# EasyEDA Pro project MCUPCB.eprj

# Schematic S1
Create Date: 2023-04-21; Page Name: P1; Project Name: MCUPCB; Schematic Name: S1; Update Date: 2023-06-19; Company: 嘉立创EDA; Page Size: A4; Version: V1.0
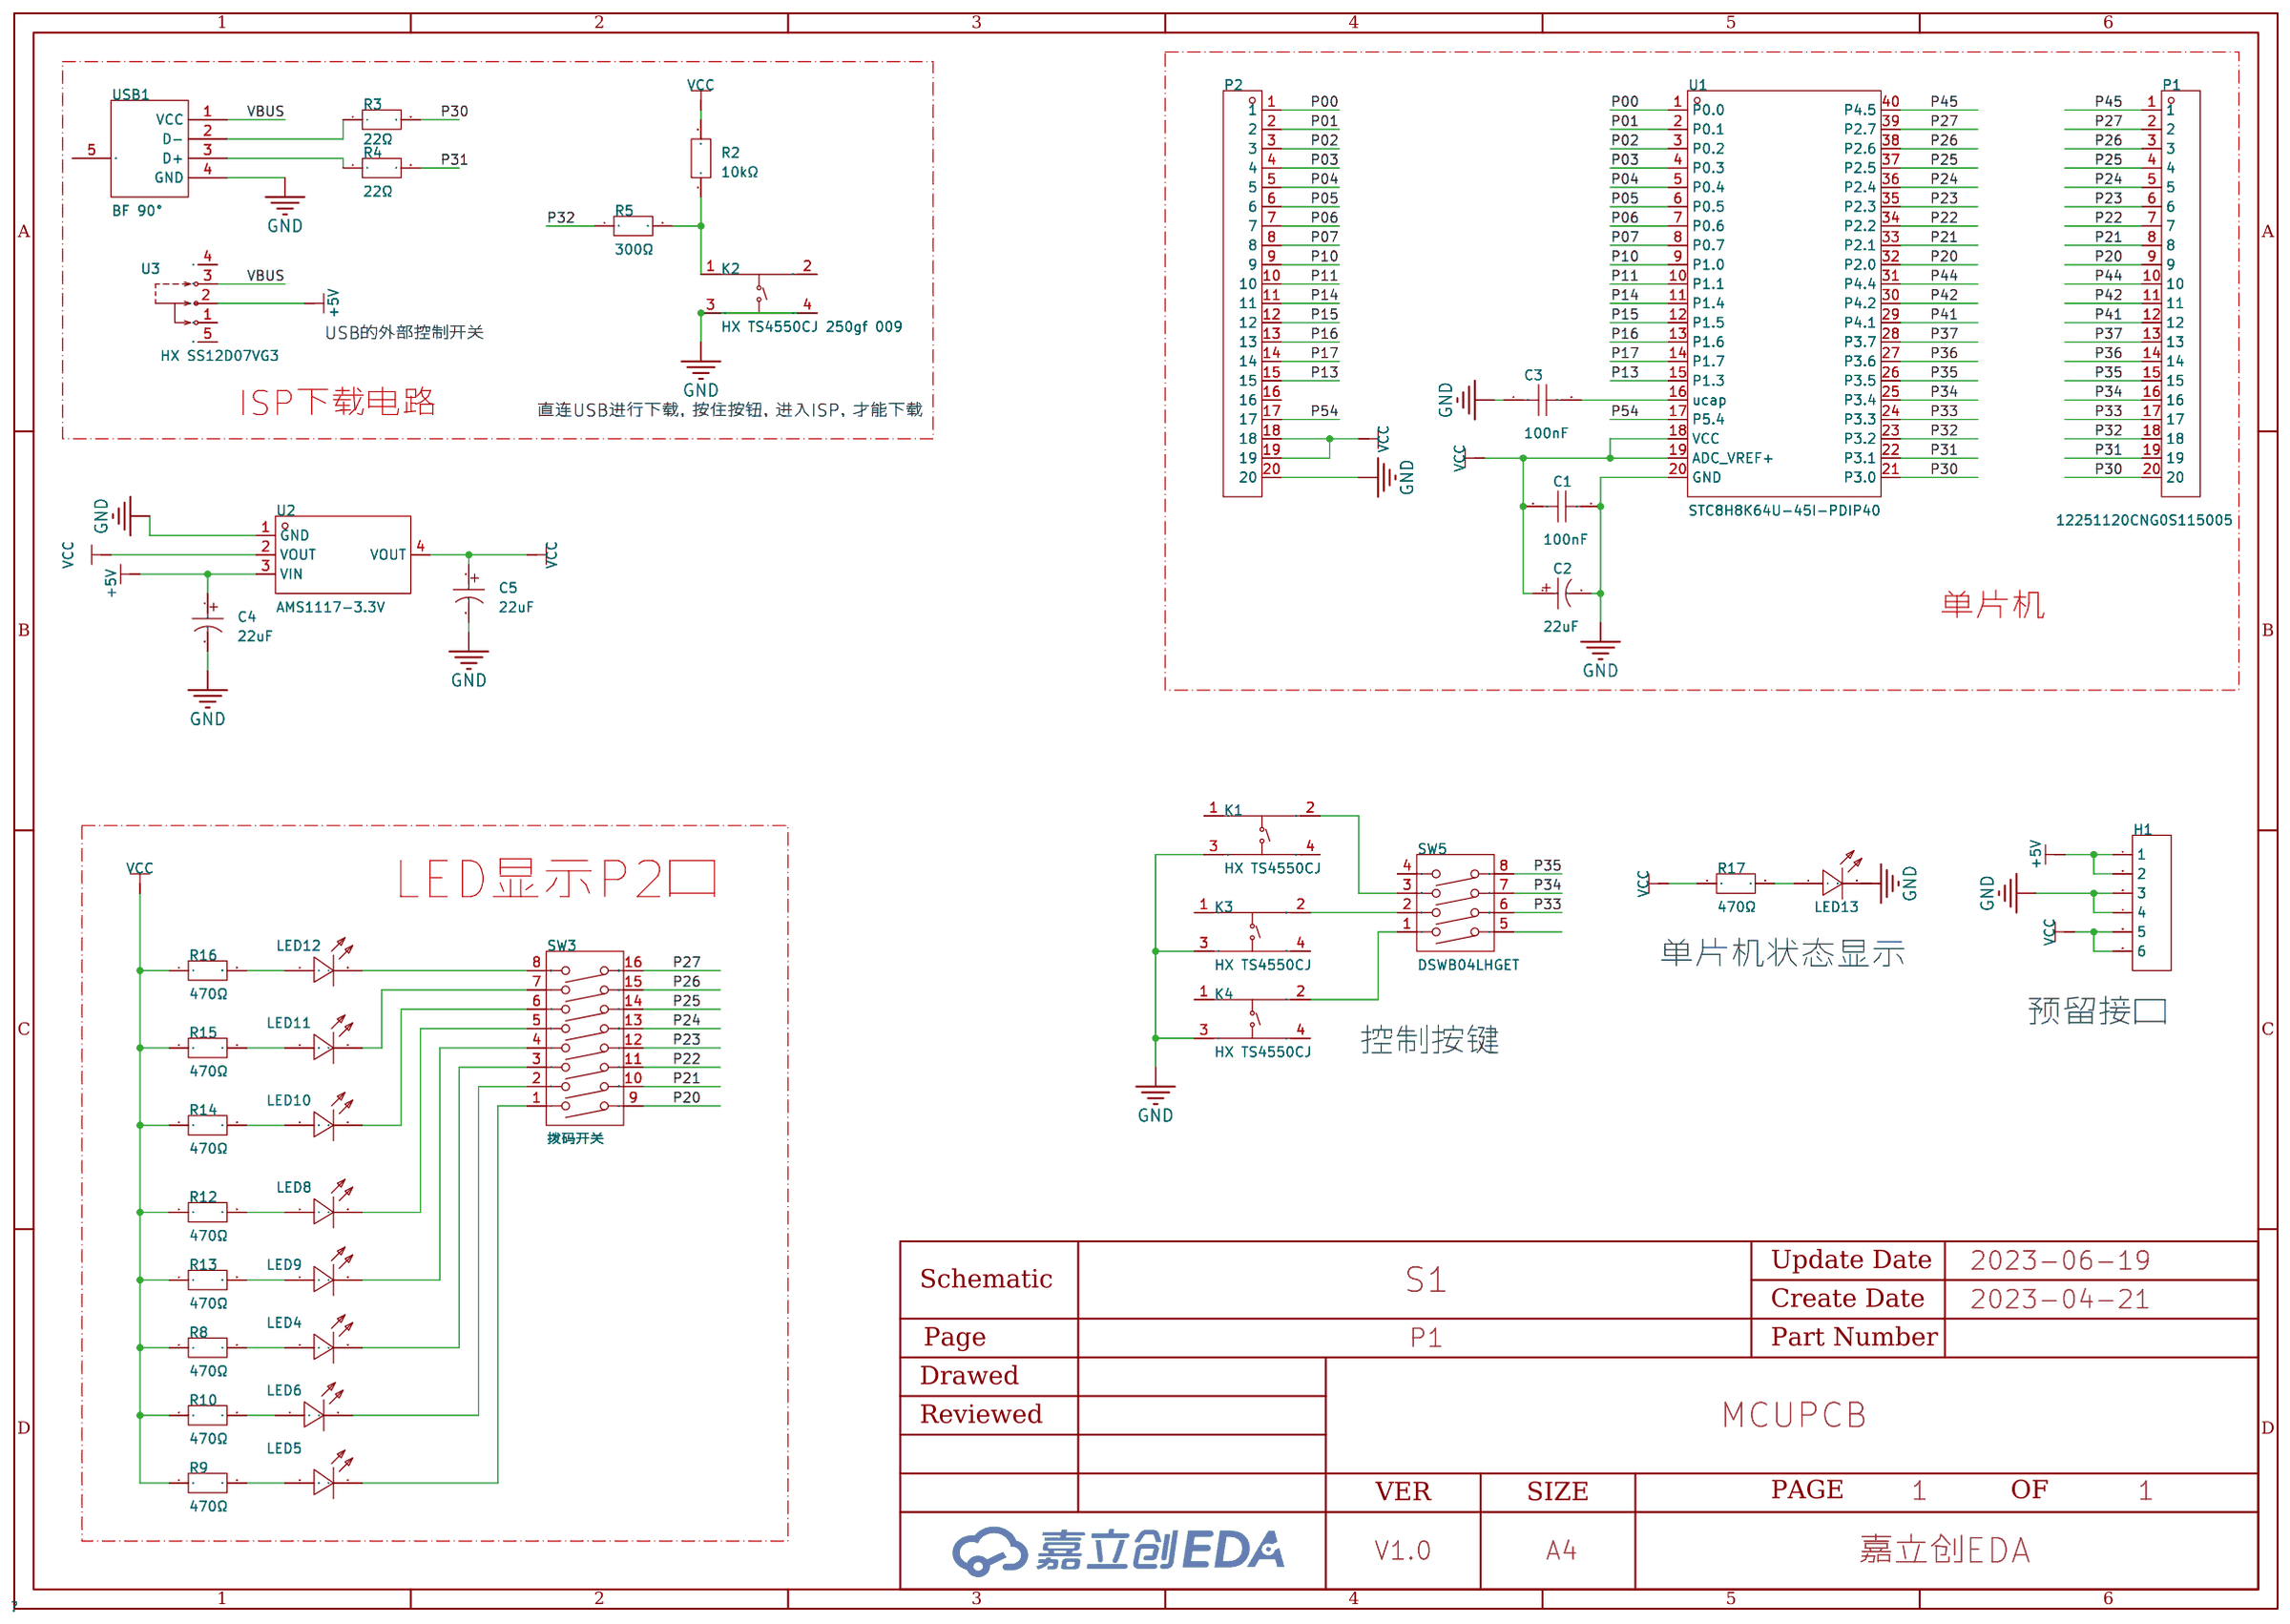
[diagram p0: schematic sheet]

## Parts
C1  100nF  [CAP-TH_L4.2-W3.8-P2.54-D0.5]
C2  22uF  [CAP-TH_BD4.0-P1.50-D0.8-FD]
C3  100nF  [CAP-TH_L4.2-W3.8-P2.54-D0.5]
C4  22uF  [CAP-TH_BD4.0-P1.50-D0.8-FD]
C5  22uF  [CAP-TH_BD4.0-P1.50-D0.8-FD]
H1  -  [HDR-TH_6P-P2.54-V-M-1]
K1  HX TS4550CJ  [SW-TH_4P-L4.5-W4.5-P3.00-LS5.0]
K2  HX TS4550CJ 250gf 009  [SW-TH_4P-L4.5-W4.5-P3.00-LS5.0]
K3  HX TS4550CJ  [SW-TH_4P-L4.5-W4.5-P3.00-LS5.0]
K4  HX TS4550CJ  [SW-TH_4P-L4.5-W4.5-P3.00-LS5.0]
LED4  TJ-L3FYTLDRMFCSFLC2R-A5  [LED-TH_BD3.8-P2.54-FD]
LED5  TJ-L3FYTLDRMFCSFLC2R-A5  [LED-TH_BD3.8-P2.54-FD]
LED6  TJ-L3FYTLDRMFCSFLC2R-A5  [LED-TH_BD3.8-P2.54-FD]
LED8  TJ-L3FYTLDRMFCSFLC2R-A5  [LED-TH_BD3.8-P2.54-FD]
LED9  TJ-L3FYTLDRMFCSFLC2R-A5  [LED-TH_BD3.8-P2.54-FD]
LED10  TJ-L3FYTLDRMFCSFLC2R-A5  [LED-TH_BD3.8-P2.54-FD]
LED11  TJ-L3FYTLDRMFCSFLC2R-A5  [LED-TH_BD3.8-P2.54-FD]
LED12  TJ-L3FYTLDRMFCSFLC2R-A5  [LED-TH_BD3.8-P2.54-FD]
LED13  TJ-L3FYTLDRMFCSFLC2R-A5  [LED-TH_BD3.8-P2.54-FD]
P1  12251120CNG0S115005  [HDR-TH_20P-P2.54-V-M-1]
P2  12251120CNG0S115005  [HDR-TH_20P-P2.54-V-M-1]
R2  10kΩ  [RES-TH_BD2.7-L6.2-P10.20-D0.4]
R3  22Ω  [RES-TH_BD2.7-L6.2-P10.20-D0.4]
R4  22Ω  [RES-TH_BD2.7-L6.2-P10.20-D0.4]
R5  300Ω  [RES-TH_BD2.7-L6.2-P10.20-D0.4]
R8  470Ω  [RES-TH_BD2.3-L6.5-P10.50-D0.5]
R9  470Ω  [RES-TH_BD2.3-L6.5-P10.50-D0.5]
R10  470Ω  [RES-TH_BD2.3-L6.5-P10.50-D0.5]
R12  470Ω  [RES-TH_BD2.3-L6.5-P10.50-D0.5]
R13  470Ω  [RES-TH_BD2.3-L6.5-P10.50-D0.5]
R14  470Ω  [RES-TH_BD2.3-L6.5-P10.50-D0.5]
R15  470Ω  [RES-TH_BD2.3-L6.5-P10.50-D0.5]
R16  470Ω  [RES-TH_BD2.3-L6.5-P10.50-D0.5]
R17  470Ω  [RES-TH_BD2.3-L6.5-P10.50-D0.5]
SW3  拨码开关  [SW-TH_DSWB08LHGET]
SW5  DSWB04LHGET  [SW-TH_DSWB04LHGET]
U1  STC8H8K64U-45I-PDIP40  [PDIP-40_L52.3-W13.7-P2.54-LS15.5-BL]
U2  AMS1117-3.3V  [SOT-223_L6.5-W3.5-P2.30-LS7.0-BR]
U3  HX SS12D07VG3  [SW-TH_SS12D07VG3]
USB1  BF 90°  [USB-B_TH_BF90]

## Library data of the parts
C1 C3 = CT4-0805B104K500F1: 容值:100nF;精度:±10%;额定电压:50V;温度系数:X7R;; LCSC Part Name: 100nF ±10% 50V; Supplier Part: C168753; Manufacturer: FH(风华); Supplier Footprint: 插件,P=2.54mm; JLCPCB Part Class: Extended Part; Datasheet: https://atta.szlcsc.com/upload/public/pdf/source/20180105/C168753_15151362164411233682.pdf; Supplier: LCSC; Tolerance: ±10%; Voltage Rated: 50V; Temperature Coefficient: X7R
C2 C4 C5 = KS226M016C07RR0VH2FP0: 容值:22uF;精度:±20%;额定电压:16V;纹波电流:-;等效串联电阻:-;; LCSC Part Name: 22uF ±20% 16V; Supplier Part: C43845; Manufacturer: CX(承兴); Supplier Footprint: 插件,D4xL7mm; JLCPCB Part Class: Extended Part; Datasheet: https://atta.szlcsc.com/upload/public/pdf/source/20211027/7B10195EF01EB9374BE8935690E3D906.pdf; Supplier: LCSC; Tolerance: ±20%; Rated Voltage: 16V; φD: 4mm; L: 7mm; Lead Spacing: 1.5mm; Lifetime @ Temp: 1000hrs@105℃
H1 = HDR-M_2.54_1x6P: Supplier Part: C37208; Supplier Footprint: 插件
K1-K4 = HX TS4550CJ 250gf 009: 触点电流：50mA 额定电压(DC)：12V 绝缘电阻：100MΩ 电路结构：单刀单掷 安装方式：直插 按钮形状：圆形按钮 按钮/盖帽颜色：黑色 带灯：无 作用力：250gf±50gf 机械寿命：100000 工作温度：-25℃~+70℃ 开关长度：4.5mm 开关宽度：4.5mm 开关高度：5mm; LCSC Part Name: 轻触开关插件 4.5*4.5*5mm按键开关 不锈钢弹片 250gf 四脚立式; Supplier Part: C5340174; Manufacturer: hanxia(韩下); Supplier Footprint: 插件; Datasheet: https://atta.szlcsc.com/upload/public/pdf/source/20221229/359234EF85A7F98504074081EE7E7D39.pdf; Supplier: LCSC
LED4-LED6 LED8-LED13 = TJ-L3FYTLDRMFCSFLC2R-A5: 发光颜色:橙红;二极管配置:-;主波长:620nm~630nm;色温:-;功率:72mW;安装方式:-;; LCSC Part Name: 橙红 圆头 短脚; Supplier Part: C440523; Manufacturer: TOGIALED(统佳); Supplier Footprint: 插件,D=3mm; JLCPCB Part Class: Extended Part; Datasheet: https://atta.szlcsc.com/upload/public/pdf/source/20191029/C440523_9662C3EC1D82ED90715B43211F389690.pdf; Supplier: LCSC; Emitted Color: 橙红; Lens Color: 雾状红; Dominant Wavelength: 620nm~630nm; Peak Wavelength: 630nm; Forward Current: 20mA; Power Dissipation: 72mW; Viewing Angle: 45°; Operating Temperature: -20℃~+80℃; Lamp Holder Type: 3mm圆形灯头
P1 P2 = 12251120CNG0S115005: 排数:单排;总PIN位数:20;间距:2.54mm;插针结构:1x20P;行距:-;安装类型:直插;圆针/方针:方针;额定电流:3A;额定电压:-;配合针长度:6mm;塑高:2.5mm;端接针长度:3mm;触头材质:黄铜;触头镀层:-;工作温度范围:-40℃~+105℃;颜色:黑色;; LCSC Part Name: 2.54mm 1x20P 直插 方针; Supplier Part: C429964; Manufacturer: JILN(锦凌); Supplier Footprint: 直插,P=2.54mm; JLCPCB Part Class: Extended Part; Datasheet: https://atta.szlcsc.com/upload/public/pdf/source/20190920/C429964_97CF577D001CBBD1C5ADC89AE690F8A2.pdf; Supplier: LCSC; Number of Rows: 单排; Number of Pins: 20; Pitch: 2.54mm; Pin Structure: 1x20P; Mounting Type: 直插; Circluar Pins/Square Pins: 方针; Current Rating (Max): 3A; Length of Mating Pin: 6mm; Insulation Height: 2.5mm; Length of End Connection Pin: 3mm; Contact Material: 黄铜; Operating Temperature Range: -40℃~+105℃; Color: 黑色
R2 = CR1/4W-10K±5%-ST52: 电阻类型:碳膜电阻;阻值:10kΩ;精度:±5%;; LCSC Part Name: 碳膜电阻 10kΩ ±5%; Supplier Part: C2894649; Manufacturer: VO(翔胜); Supplier Footprint: 插件,2.7x6.2mm; JLCPCB Part Class: Extended Part; Datasheet: https://atta.szlcsc.com/upload/public/pdf/source/20210803/C2857407_45FF53FE186CAB545115AD37303966CD.pdf; Supplier: LCSC; Type: 碳膜电阻; Tolerance: ±5%; Temperature Coefficient: ±350ppm/℃; Overload Voltage (Max): 250V; Operating Temperature Range: -55℃~+155℃
R3 R4 = CR1/4W-22Ω±5%-RT52: 电阻类型:碳膜电阻;阻值:22Ω;精度:±5%;功率:250mW;温度系数:±350ppm/℃;最大工作电压:250V;工作温度范围:-55℃~+155℃;; LCSC Part Name: 碳膜电阻 22Ω ±5% 250mW; Supplier Part: C2894527; Manufacturer: VO(翔胜); Supplier Footprint: 插件,2.7x6.2mm; JLCPCB Part Class: Extended Part; Datasheet: https://atta.szlcsc.com/upload/public/pdf/source/20210803/C2857407_45FF53FE186CAB545115AD37303966CD.pdf; Supplier: LCSC; Type: 碳膜电阻; Tolerance: ±5%; Power(Watts): 250mW; Temperature Coefficient: ±350ppm/℃; Overload Voltage (Max): 250V; Operating Temperature Range: -55℃~+155℃
R5 = CR1/4W-300Ω±5%-ST26: 电阻类型:碳膜电阻;阻值:300Ω;精度:±5%;功率:250mW;温度系数:±350ppm/℃;最大工作电压:250V;工作温度范围:-55℃~+155℃;; LCSC Part Name: 碳膜电阻 300Ω ±5% 250mW; Supplier Part: C2894628; Manufacturer: VO(翔胜); Supplier Footprint: 插件,2.7x6.2mm; JLCPCB Part Class: Extended Part; Datasheet: https://atta.szlcsc.com/upload/public/pdf/source/20210803/C2857407_45FF53FE186CAB545115AD37303966CD.pdf; Supplier: LCSC; Type: 碳膜电阻; Tolerance: ±5%; Power(Watts): 250mW; Temperature Coefficient: ±350ppm/℃; Overload Voltage (Max): 250V; Operating Temperature Range: -55℃~+155℃
R8-R10 R12-R17 = CF1/4W-470Ω±5%T52: 电阻类型:碳膜电阻;阻值:470Ω;精度:±5%;功率:250mW;温度系数:-1500ppm/℃~+300ppm/℃;最大工作电压:250V;工作温度范围:-55℃~+125℃;; LCSC Part Name: 碳膜电阻 470Ω ±5% 250mW; Supplier Part: C714293; Manufacturer: 华星机电; Supplier Footprint: 轴向引线; JLCPCB Part Class: Extended Part; Datasheet: https://atta.szlcsc.com/upload/public/pdf/source/20200731/C714221_427FBDC3BB0D7DD1C4F442D16274C99B.pdf; Supplier: LCSC; Type: 碳膜电阻; Tolerance: ±5%; Power(Watts): 250mW; Temperature Coefficient: -1500ppm/℃~+300ppm/℃; Overload Voltage (Max): 250V; Operating Temperature Range: -55℃~+125℃
SW3 = 拨码开关,平拨开关,DSWB08LHGET: 类型:平拨，凸起式;电路结构:单刀单掷;开关位数:8;引脚间距:2.54mm;颜色:红色;; Supplier Part: C99413; Manufacturer: YE; Supplier Footprint: DIP-16; JLCPCB Part Class: Extended Part; Datasheet: https://atta.szlcsc.com/upload/public/pdf/source/20170330/1490854214069.pdf; Supplier: LCSC; Type: 平拨，凸起式; Circuit: 单刀单掷; Number of Positions: 8; Lead Pitch: 2.54mm; Color: 红色
SW5 = 拨码开关,平拨开关,DSWB04LHGET: 类型:平拨，凸起式;电路结构:单刀单掷;开关位数:4;引脚间距:2.54mm;颜色:红色;; Supplier Part: C99418; Manufacturer: YE; Supplier Footprint: DIP; JLCPCB Part Class: Extended Part; Datasheet: https://atta.szlcsc.com/upload/public/pdf/source/20220830/02827E67A8727938D957A3CE4C86C92D.pdf; Supplier: LCSC; Type: 平拨，凸起式; Circuit: 单刀单掷; Number of Positions: 4; Lead Pitch: 2.54mm; Color: 红色
U1 = STC8H8K64U-45I-PDIP40: 单片机@@全速USB，DMA支持：TFT彩屏接口，4个串口，SPI,ADC,RTC; Supplier Part: C2987962; Manufacturer: STC(宏晶); Supplier Footprint: PDIP-40; JLCPCB Part Class: Extended Part; Datasheet: https://atta.szlcsc.com/upload/public/pdf/source/20220208/F43AF8AFB82417D1483669F3A0ABE01D.pdf; Supplier: LCSC
U2 = AMS1117-3.3V_C173386: 输出类型:固定;输出极性:正;最大输入电压:12V;输出电压:3.3V;输出电流:800mA;电源纹波抑制比(PSRR):75dB@(10kHz);; LCSC Part Name: 输入12V 输出3.3V 800mA; Supplier Part: C173386; Manufacturer: FM(富满); Supplier Footprint: SOT-223; JLCPCB Part Class: Extended Part; Datasheet: https://atta.szlcsc.com/upload/public/pdf/source/20220413/D87C9CA81FB1DC5781774A1801C4CAE4.pdf; Supplier: LCSC; Output Type: 固定; Output Polarity: 正; Number of Outputs: 1; Maximum Input Voltage: 12V; Output Voltage: 3.3V; Dropout Voltage: 1.5V@(700mA); Output Current: 800mA; Power Supply Rejection Ratio (PSRR): 75dB@(10kHz)
U3 = HX SS12D07VG3: LCSC Part Name: 3脚2两档位SS12D07VG3 1P2T立式拨动开关,柄长3mm; Supplier Part: C5149825; Manufacturer: hanxia(韩下); Supplier Footprint: 插件; JLCPCB Part Class: Extended Part; Datasheet: https://atta.szlcsc.com/upload/public/pdf/source/20220907/9905FF2C6AFF0D7ECD846AFFBA045CCB.pdf; Supplier: LCSC
USB1 = BF 90°: 连接器类型:Type-B;标准:USB 2.0;公母:母座;触点数量:4;端口数量:1;安装方式:弯插;额定电流 - 电源:1.5A;工作温度范围:-25℃~+85℃;; LCSC Part Name: Type-B 母座 弯插 白胶 有后盖; Supplier Part: C456014; Manufacturer: SHOU HAN(首韩); Supplier Footprint: 插件; JLCPCB Part Class: Extended Part; Datasheet: https://atta.szlcsc.com/upload/public/pdf/source/20191113/C456014_C740506ED5D4B26CF619D62A688F072E.pdf; Supplier: LCSC; Connector Type: Type-B; Standard: USB 2.0; Gender: 母座; Number of Contacts: 4; Number of Ports: 1; Mounting Style: 弯插; Current Rating - Power (Max): 1.5A; Operating Temperature Range: -25℃~+85℃

## Nets
+5V: C4.1 H1.1 H1.2 U2.3(VIN) U3.2
GND: C1.1 C2.2 C3.1 C4.2 C5.2 H1.3 H1.4 K1.3(C) K2.3(C) K2.4(D) K3.3(C) K4.3(C) LED13.2(K) P2.20 U1.20(GND) U2.1(GND) USB1.4(GND)
VBUS: U3.3 USB1.1(VCC)
VCC: C1.2 C2.1 C5.1 H1.5 H1.6 P2.18 P2.19 R2.2 R8.1 R9.1 R10.1 R12.1 R13.1 R14.1 R15.1 R16.1 R17.1 U1.18(VCC) U1.19(ADC_VREF+) U2.2(VOUT) U2.4(VOUT)
P00: P2.1 U1.1(P0.0)
P01: P2.2 U1.2(P0.1)
P02: P2.3 U1.3(P0.2)
P03: P2.4 U1.4(P0.3)
P04: P2.5 U1.5(P0.4)
P05: P2.6 U1.6(P0.5)
P06: P2.7 U1.7(P0.6)
P07: P2.8 U1.8(P0.7)
P10: P2.9 U1.9(P1.0)
P11: P2.10 U1.10(P1.1)
P13: P2.15 U1.15(P1.3)
P14: P2.11 U1.11(P1.4)
P15: P2.12 U1.12(P1.5)
P16: P2.13 U1.13(P1.6)
P17: P2.14 U1.14(P1.7)
P20: P1.9 SW3.9 U1.32(P2.0)
P21: P1.8 SW3.10 U1.33(P2.1)
P22: P1.7 SW3.11 U1.34(P2.2)
P23: P1.6 SW3.12 U1.35(P2.3)
P24: P1.5 SW3.13 U1.36(P2.4)
P25: P1.4 SW3.14 U1.37(P2.5)
P26: P1.3 SW3.15 U1.38(P2.6)
P27: P1.2 SW3.16 U1.39(P2.7)
P30: P1.20 R3.2 U1.21(P3.0)
P31: P1.19 R4.2 U1.22(P3.1)
P32: P1.18 R5.1 U1.23(P3.2)
P33: P1.17 SW5.6 U1.24(P3.3)
P34: P1.16 SW5.7 U1.25(P3.4)
P35: P1.15 SW5.8 U1.26(P3.5)
P36: P1.14 U1.27(P3.6)
P37: P1.13 U1.28(P3.7)
P41: P1.12 U1.29(P4.1)
P42: P1.11 U1.30(P4.2)
P44: P1.10 U1.31(P4.4)
P45: P1.1 U1.40(P4.5)
P54: P2.17 U1.17(P5.4)
$1N1688: K2.1(A) R2.1 R5.2
$1N1822: R3.1 USB1.2(D-)
$1N1826: R4.1 USB1.3(D+)
$1N2054: C3.2 U1.16(ucap)
$1N3268: LED4.1(A) R8.2
$1N3345: LED5.1(A) R9.2
$1N3423: LED6.1(A) R10.2
$1N3487: LED4.2(K) SW3.3
$1N3491: LED6.2(K) SW3.2
$1N3495: LED5.2(K) SW3.1
$1N3652: LED8.1(A) R12.2
$1N3729: LED9.1(A) R13.2
$1N3822: LED10.1(A) R14.2
$1N3899: LED11.1(A) R15.2
$1N3906: LED9.2(K) SW3.4
$1N3914: LED8.2(K) SW3.5
$1N3922: LED10.2(K) SW3.6
$1N4027: LED12.1(A) R16.2
$1N4031: LED11.2(K) SW3.7
$1N4039: LED12.2(K) SW3.8
$1N4277: K3.2(B) SW5.2
$1N4282: K4.2(B) SW5.1
$1N4288: K1.2(B) SW5.3
$1N5607: LED13.1(A) R17.2

Not connected (* = marked no-connect by the designer): K1 1(A) 4(D); K2 2(B); K3 1(A) 4(D); K4 1(A) 4(D); P2 16; SW5 4 5; U3 1 4 5; USB1 5(EH)

## Notes on the sheet
- USB的外部控制开关
- ISP下载电路
- 直连USB进行下载，按住按钮，进入ISP，才能下载
- 单片机
- LED显示P2口
- 单片机状态显示
- 预留接口
- 控制按键

# Board PCB1
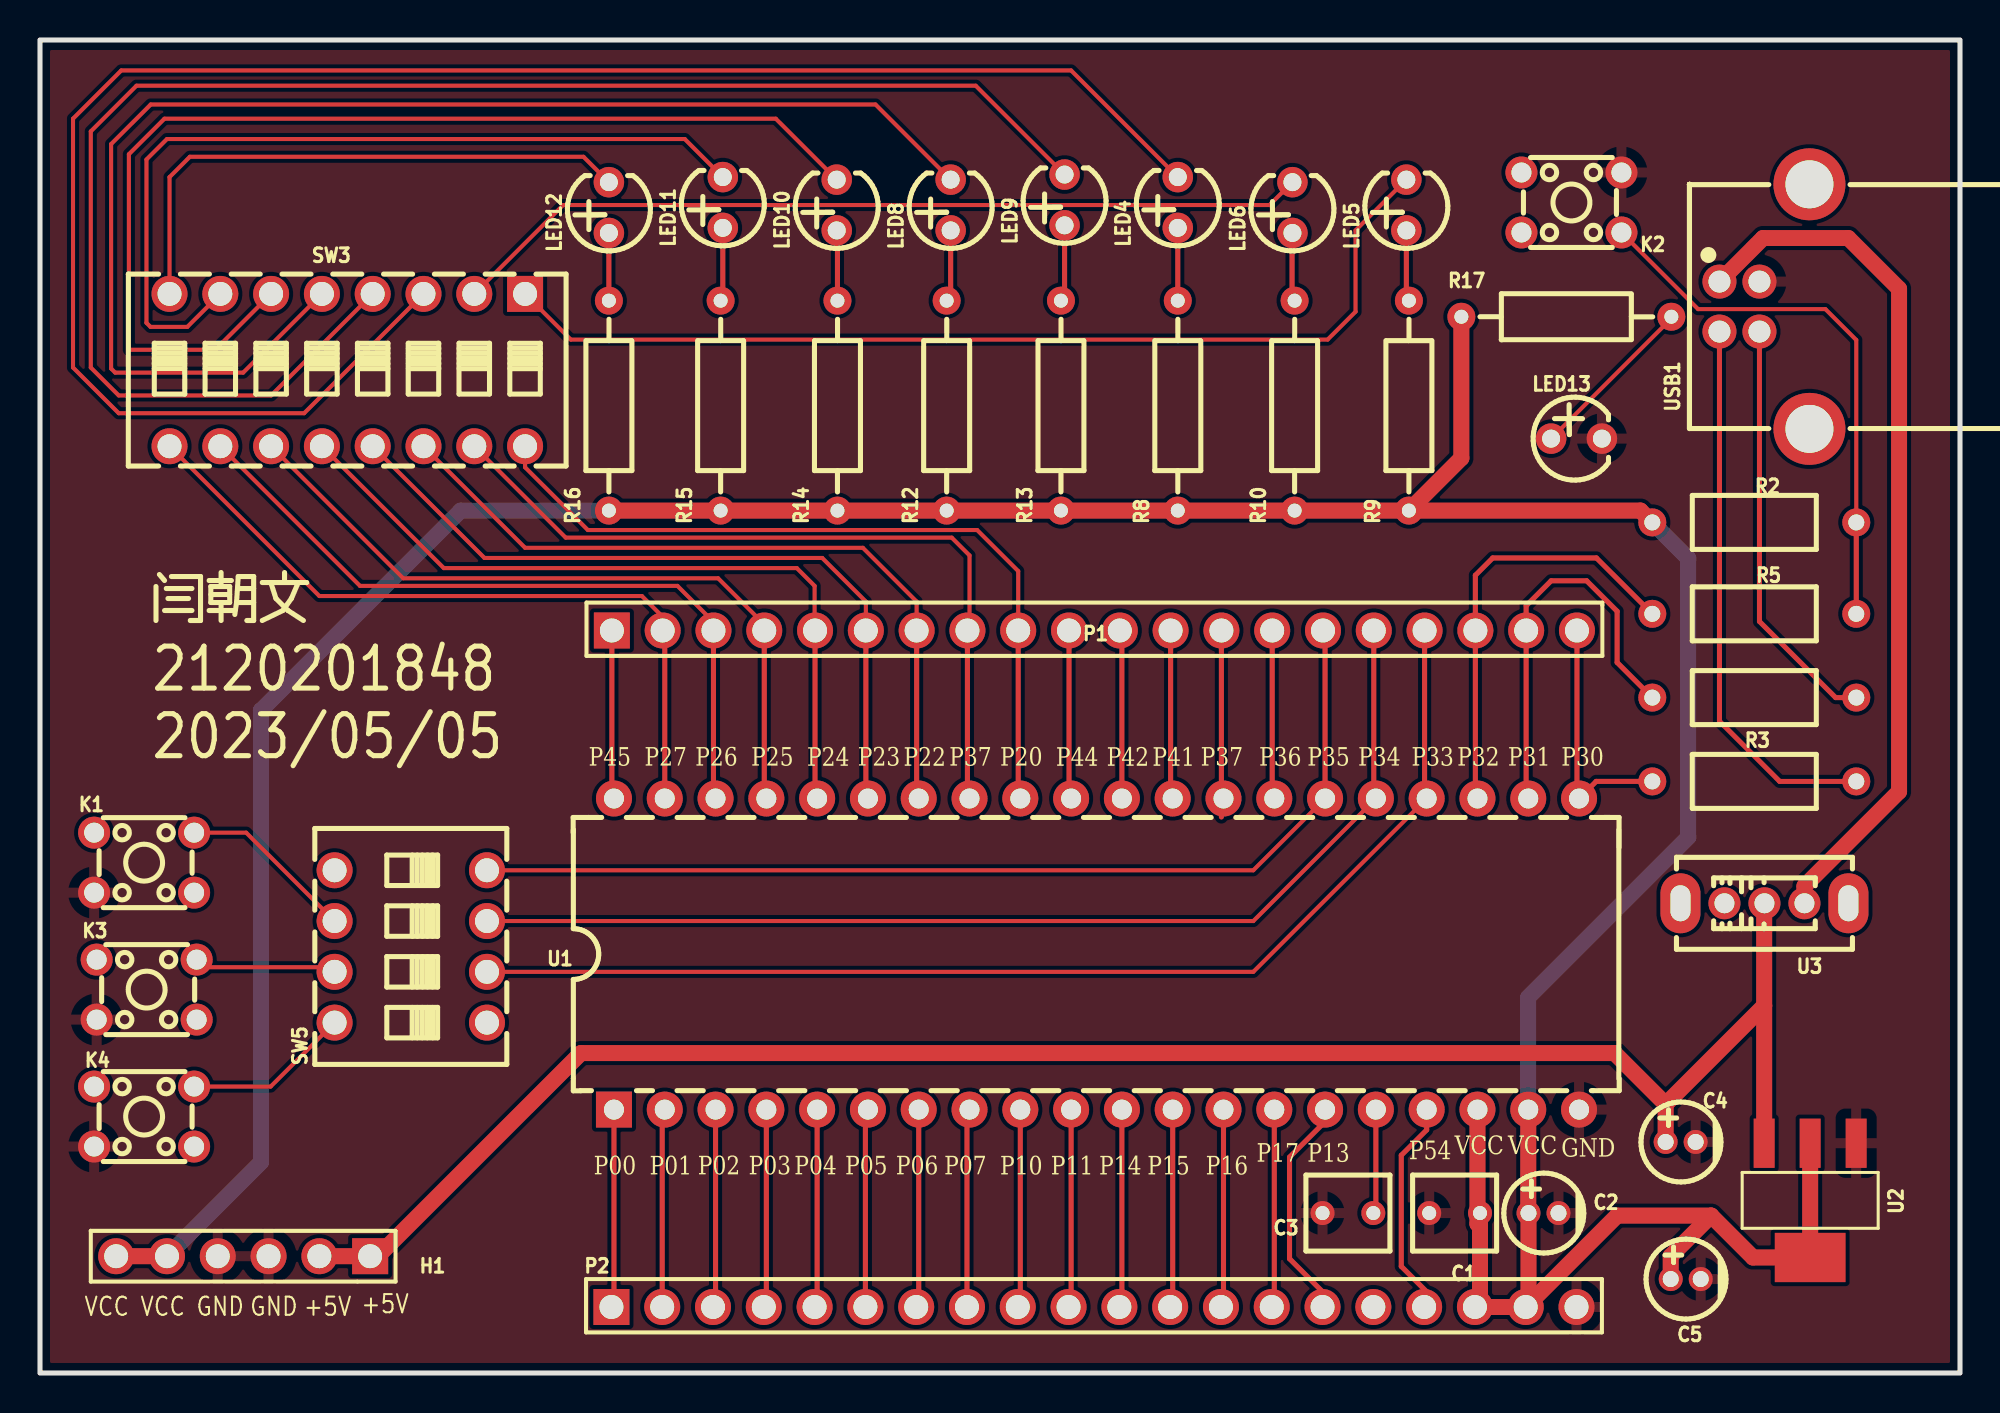
[diagram p1: board, top side]
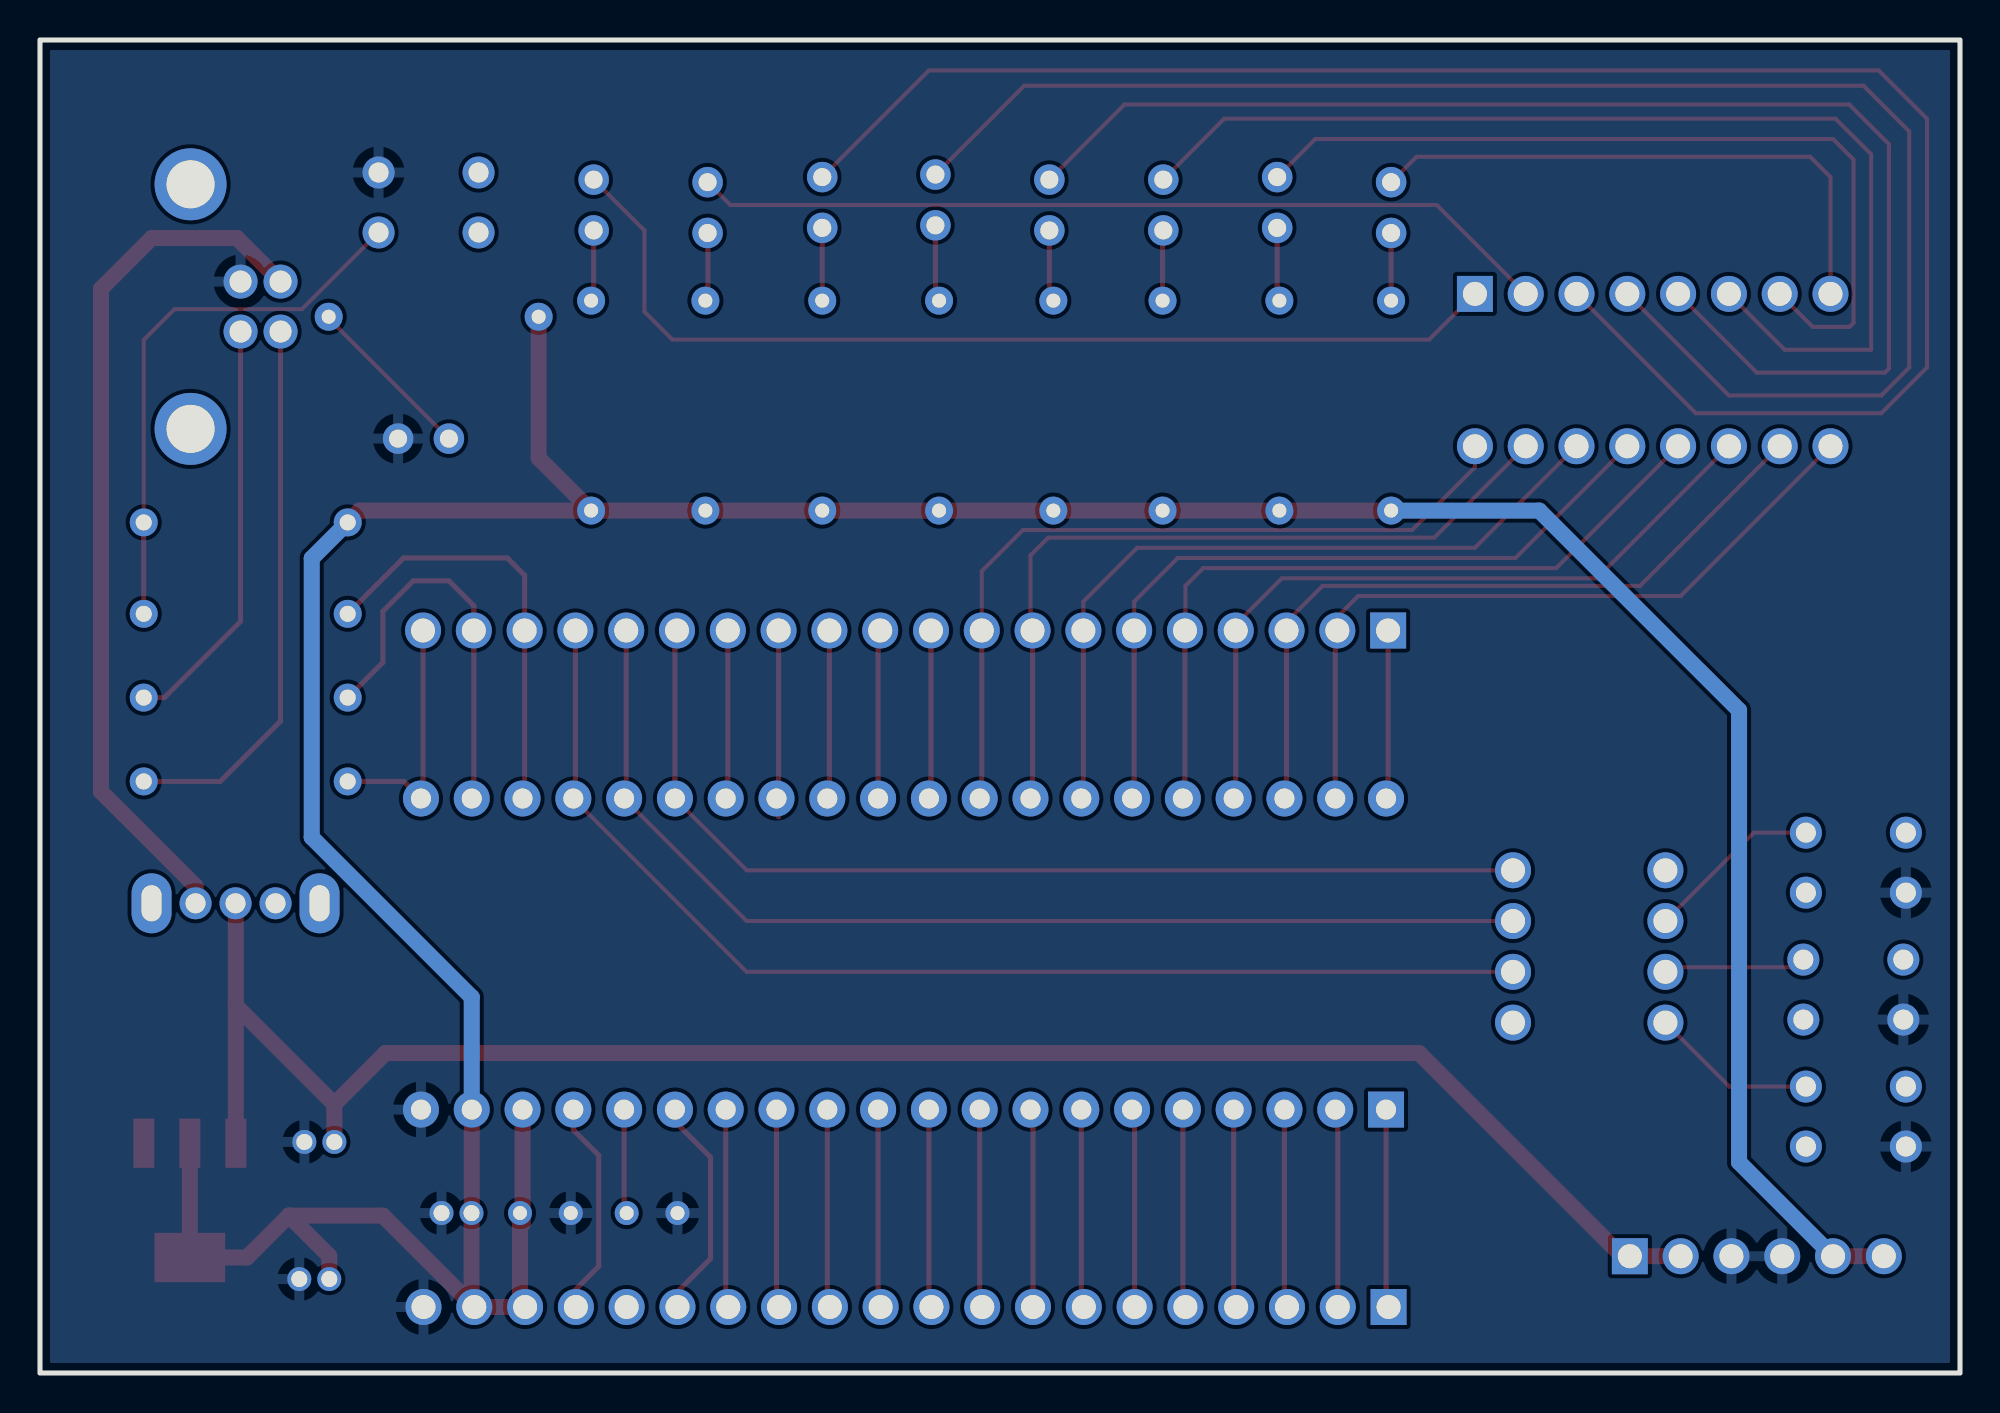
[diagram p2: board, bottom side, seen from below]

Outline 96.01 x 66.67 mm; copper layers: Top Layer, Bottom Layer. Coordinates in mm from the lower left corner of the outline.
Outline path: rectangle 0,66.67 96.01,0
Stack: Top Layer 0.035mm / Dielectric1 1.51mm FR4 er 4.5 / Bottom Layer 0.035mm

## Design rules (mm)
template: JLCPCB Capability(Two Layers Board)
spacing copperThickness1oz (default): track to track 0.102, other pairs 0.152 to 0.3
spacing copperThickness2oz: track to track 0.203, other pairs 0.152 to 0.3
track width copperThickness1oz (default): min 0.127, default 0.254, max 2.54
track width copperThickness2oz: min 0.203, default 0.254, max 2.54
differential pair differentialPair (default): width min 0.127, default 0.254, max 2.54; gap min 0.152, default 0.152
via viaSize (default): diameter min 0.5, default 0.61, max 10; hole min 0.3, default 0.305, max 6.3

## Placement (name value [footprint] x y rotation side)
C1  100nF  [CAP-TH_L4.2-W3.8-P2.54-D0.5]  70.74 8 0 top
C2  22uF  [CAP-TH_BD4.0-P1.50-D0.8-FD]  75.18 8 0 top
C3  100nF  [CAP-TH_L4.2-W3.8-P2.54-D0.5]  65.41 8 0 top
C4  22uF  [CAP-TH_BD4.0-P1.50-D0.8-FD]  82.04 11.56 0 top
C5  22uF  [CAP-TH_BD4.0-P1.50-D0.8-FD]  82.3 4.7 0 top
H1  -  [HDR-TH_6P-P2.54-V-M-1]  10.16 5.84 180 top
K1  HX TS4550CJ  [SW-TH_4P-L4.5-W4.5-P3.00-LS5.0]  5.21 25.53 0 top
K2  HX TS4550CJ 250gf 009  [SW-TH_4P-L4.5-W4.5-P3.00-LS5.0]  76.58 58.55 180 top
K3  HX TS4550CJ  [SW-TH_4P-L4.5-W4.5-P3.00-LS5.0]  5.33 19.18 0 top
K4  HX TS4550CJ  [SW-TH_4P-L4.5-W4.5-P3.00-LS5.0]  5.21 12.83 0 top
LED4  TJ-L3FYTLDRMFCSFLC2R-A5  [LED-TH_BD3.8-P2.54-FD]  56.9 58.55 90 top
LED5  TJ-L3FYTLDRMFCSFLC2R-A5  [LED-TH_BD3.8-P2.54-FD]  68.33 58.42 90 top
LED6  TJ-L3FYTLDRMFCSFLC2R-A5  [LED-TH_BD3.8-P2.54-FD]  62.63 58.29 90 top
LED8  TJ-L3FYTLDRMFCSFLC2R-A5  [LED-TH_BD3.8-P2.54-FD]  45.54 58.42 90 top
LED9  TJ-L3FYTLDRMFCSFLC2R-A5  [LED-TH_BD3.8-P2.54-FD]  51.24 58.67 90 top
LED10  TJ-L3FYTLDRMFCSFLC2R-A5  [LED-TH_BD3.8-P2.54-FD]  39.84 58.42 90 top
LED11  TJ-L3FYTLDRMFCSFLC2R-A5  [LED-TH_BD3.8-P2.54-FD]  34.15 58.55 90 top
LED12  TJ-L3FYTLDRMFCSFLC2R-A5  [LED-TH_BD3.8-P2.54-FD]  28.45 58.29 90 top
LED13  TJ-L3FYTLDRMFCSFLC2R-A5  [LED-TH_BD3.8-P2.54-FD]  76.84 46.74 0 top
P1  12251120CNG0S115005  [HDR-TH_20P-P2.54-V-M-1]  52.73 37.14 0 top
P2  12251120CNG0S115005  [HDR-TH_20P-P2.54-V-M-1]  52.71 3.3 0 top
R2  10kΩ  [RES-TH_BD2.7-L6.2-P10.20-D0.4]  85.72 42.54 180 top
R3  22Ω  [RES-TH_BD2.7-L6.2-P10.20-D0.4]  85.72 29.59 180 top
R4  22Ω  [RES-TH_BD2.7-L6.2-P10.20-D0.4]  85.72 33.78 180 top
R5  300Ω  [RES-TH_BD2.7-L6.2-P10.20-D0.4]  85.72 37.97 0 top
R8  470Ω  [RES-TH_BD2.3-L6.5-P10.50-D0.5]  56.9 48.39 90 top
R9  470Ω  [RES-TH_BD2.3-L6.5-P10.50-D0.5]  68.45 48.39 90 top
R10  470Ω  [RES-TH_BD2.3-L6.5-P10.50-D0.5]  62.74 48.39 90 top
R12  470Ω  [RES-TH_BD2.3-L6.5-P10.50-D0.5]  45.34 48.39 90 top
R13  470Ω  [RES-TH_BD2.3-L6.5-P10.50-D0.5]  51.05 48.39 90 top
R14  470Ω  [RES-TH_BD2.3-L6.5-P10.50-D0.5]  39.88 48.39 90 top
R15  470Ω  [RES-TH_BD2.3-L6.5-P10.50-D0.5]  34.04 48.39 90 top
R16  470Ω  [RES-TH_BD2.3-L6.5-P10.50-D0.5]  28.45 48.39 90 top
R17  470Ω  [RES-TH_BD2.3-L6.5-P10.50-D0.5]  76.33 52.83 0 top
SW3  拨码开关  [SW-TH_DSWB08LHGET]  15.37 50.16 180 top
SW5  DSWB04LHGET  [SW-TH_DSWB04LHGET]  18.54 21.34 90 top
U1  STC8H8K64U-45I-PDIP40  [PDIP-40_L52.3-W13.7-P2.54-LS15.5-BL]  52.83 20.95 0 top
U2  AMS1117-3.3V  [SOT-223_L6.5-W3.5-P2.30-LS7.0-BR]  88.52 8.64 90 top
U3  HX SS12D07VG3  [SW-TH_SS12D07VG3]  86.23 23.49 0 top
USB1  BF 90°  [USB-B_TH_BF90]  86.23 53.34 90 top

## Footprints (pads in the part's own frame, mm; a bottom-side part is the same pattern mirrored in y, then rotated)
CAP-TH_BD4.0-P1.50-D0.8-FD
  round 1.2 hole 0.8: 1(-0.75,0) 2(0.75,0)
CAP-TH_L4.2-W3.8-P2.54-D0.5
  round 1.2 hole 0.7: 1(-1.27,0) 2(1.27,0)
HDR-TH_6P-P2.54-V-M-1
  rect 1.8x1.8 hole 1.2: 1(-6.35,0)
  round 1.8 hole 1.2: 2(-3.81,0) 3(-1.27,0) 4(1.27,0) 5(3.81,0) 6(6.35,0)
HDR-TH_20P-P2.54-V-M-1
  rect 1.8x1.8 hole 1.2: 1(-24.13,0)
  round 1.8 hole 1.2: 2(-21.59,0) 3(-19.05,0) 4(-16.51,0) 5(-13.97,0) 6(-11.43,0) 7(-8.89,0) 8(-6.35,0) 9(-3.81,0) 10(-1.27,0) 11(1.27,0) 12(3.81,0) 13(6.35,0) 14(8.89,0) 15(11.43,0) 16(13.97,0) 17(16.51,0) 18(19.05,0) 19(21.59,0) 20(24.13,0)
LED-TH_BD3.8-P2.54-FD
  round 1.524 hole 0.9: 1(-1.27,0) 2(1.27,0)
PDIP-40_L52.3-W13.7-P2.54-LS15.5-BL
  rect 1.8x1.8 hole 1: 1(-24.13,-7.78)
  round 1.8 hole 1: 2(-21.59,-7.78) 3(-19.05,-7.78) 4(-16.51,-7.78) 5(-13.97,-7.78) 6(-11.43,-7.78) 7(-8.89,-7.78) 8(-6.35,-7.78) 9(-3.81,-7.78) 10(-1.27,-7.78) 11(1.27,-7.78) 12(3.81,-7.78) 13(6.35,-7.78) 14(8.89,-7.78) 15(11.43,-7.78) 16(13.97,-7.78) 17(16.51,-7.78) 18(19.05,-7.78) 19(21.59,-7.78) 20(24.13,-7.78) 21(24.13,7.78) 22(21.59,7.78) 23(19.05,7.78) 24(16.51,7.78) 25(13.97,7.78) 26(11.43,7.78) 27(8.89,7.78) 28(6.35,7.78) 29(3.81,7.78) 30(1.27,7.78) 31(-1.27,7.78) 32(-3.81,7.78) 33(-6.35,7.78) 34(-8.89,7.78) 35(-11.43,7.78) 36(-13.97,7.78) 37(-16.51,7.78) 38(-19.05,7.78) 39(-21.59,7.78) 40(-24.13,7.78)
RES-TH_BD2.3-L6.5-P10.50-D0.5
  round 1.4 hole 0.7: 1(-5.25,0) 2(5.25,0)
RES-TH_BD2.7-L6.2-P10.20-D0.4
  round 1.4 hole 0.8: 1(-5.1,0) 2(5.1,0)
SOT-223_L6.5-W3.5-P2.30-LS7.0-BR
  rect 2.465x1.05 smd: 1(2.857,-2.3) 2(2.857,0) 3(2.857,2.3)
  rect 2.465x3.54 smd: 4(-2.857,0)
SW-TH_4P-L4.5-W4.5-P3.00-LS5.0
  round 1.6 hole 1: 1(-2.5,1.5) 2(2.5,1.5) 3(-2.5,-1.5) 4(2.5,-1.5)
SW-TH_DSWB04LHGET
  round 1.8 hole 1.2: 1(-3.81,3.81) 2(-1.27,3.81) 3(1.27,3.81) 4(3.81,3.81) 5(-3.81,-3.81) 6(-1.27,-3.81) 7(1.27,-3.81) 8(3.81,-3.81)
SW-TH_DSWB08LHGET
  rect 1.8x1.8 hole 1.2: 1(-8.89,-3.81)
  round 1.8 hole 1.2: 2(-6.35,-3.81) 3(-3.81,-3.81) 4(-1.27,-3.81) 5(1.27,-3.81) 6(3.81,-3.81) 7(6.35,-3.81) 8(8.89,-3.81) 9(-8.89,3.81) 10(-6.35,3.81) 11(-3.81,3.81) 12(-1.27,3.81) 13(1.27,3.81) 14(3.81,3.81) 15(6.35,3.81) 16(8.89,3.81)
SW-TH_SS12D07VG3
  oval 1.6x1.6 hole 1: 1(-2,0) 2(0,0) 3(2,0)
  oval 2x3 hole 1x1.8: 4(4.2,0) 5(-4.2,0)
USB-B_TH_BF90
  round 1.7 hole 1.1: 1(1.25,2.25) 2(-1.25,2.25) 3(-1.25,0.25) 4(1.25,0.25)
  round 3.6 hole 2.4: 5(-6.117,-2.25) 5(6.117,-2.25)

## Nets
As in the schematic, except:
GND: C1.1 C2.2 C3.1 C4.2 C5.2 H1.3 H1.4 K1.3 K2.3 K3.3 K4.3 LED13.2 P2.20 U1.20 U2.1 USB1.4

Pads without a net: K1 1 4; K2 2 4; K3 1 4; K4 1 4; P2 16; SW5 4; U3 1 4 5; USB1 5

## Routing (per net, layer and track width the routed paths; a pad name or vN(x,y) marks a point on that pad's centre or on a via; arc(x,y) is an arc through that point)
+5V: length 93.5
  Top Layer w0.8: U3.2 86.22,23.48 86.22,18.37 ; C4.1 81.29,13.44 ; 81.29,13.44 78.73,16 27.05,16 16.89,5.84 H1.1 H1.2 ; 81.29,13.44 86.22,18.37 ; 86.22,18.37 U2.3
VBUS: length 43.6
  Top Layer w0.8: U3.3 88.23,24.35 92.96,29.08 92.96,54.23 90.42,56.77 86.16,56.77 USB1.1
VCC: length 199.7
  Top Layer w0.8: U1.18 71.88,7.46 72.01,7.33 ; 72.01,7.33 72.01,3.56 P2.18 P2.19 74.43,3.44 ; 72.01,7.33 C1.2 ; R2.2 80.03,43.14 R9.1 ; 83.57,7.87 81.55,5.85 C5.1 ; 83.57,7.87 85.66,5.78 U2.4 U2.2 ; 83.57,7.87 78.87,7.87 74.43,3.44 ; R9.1 71.08,45.76 R17.1 ; R9.1 R10.1 R13.1 R12.1 R14.1 R15.1 R16.1 ; U1.19 74.42,8.01 C2.1 74.43,3.44 ; H1.6 H1.5
  Bottom Layer w0.8: H1.5 11.05,10.54 11.05,33.15 21.04,43.14 R16.1 ; R2.2 82.42,40.75 82.42,26.8 74.42,18.8 U1.19
P00: length 9.9
  Top Layer w0.254: P2.1 28.7,3.43 U1.1
P01: length 9.9
  Top Layer w0.254: U1.2 31.12,13.05 P2.2
P02: length 9.9
  Top Layer w0.254: U1.3 33.78,3.43 P2.3
P03: length 9.9
  Top Layer w0.254: P2.4 36.32,3.43 U1.4
P04: length 9.9
  Top Layer w0.254: U1.5 38.86,3.43 P2.5
P05: length 9.9
  Top Layer w0.254: U1.6 41.28,13.05 P2.6
P06: length 9.9
  Top Layer w0.254: U1.7 43.94,3.43 P2.7
P07: length 9.9
  Top Layer w0.254: P2.8 46.35,13.05 U1.8
P10: length 9.9
  Top Layer w0.254: U1.9 49.02,3.43 P2.9
P11: length 9.9
  Top Layer w0.254: P2.10 51.56,3.43 U1.10
P13: length 11.3
  Top Layer w0.254: P2.15 64.13,4.06 62.48,5.71 62.48,10.79 64.26,12.57 U1.15
P14: length 9.9
  Top Layer w0.254: U1.11 54.1,3.43 P2.11
P15: length 9.9
  Top Layer w0.254: U1.12 56.64,3.43 P2.12
P16: length 9.9
  Top Layer w0.254: P2.13 59.18,3.43 U1.13
P17: length 9.9
  Top Layer w0.254: P2.14 61.72,3.43 U1.14
P20: length 39.3
  Top Layer w0.203: P1.9 48.92,40.11 46.86,42.16 27.4,42.16 24.26,45.3 SW3.9
  Top Layer w0.254: U1.32 48.92,28.84 P1.9
P21: length 39.3
  Top Layer w0.203: P1.8 46.48,37.24 46.48,40.89 45.59,41.78 26.29,41.78 SW3.10
  Top Layer w0.254: U1.33 46.38,28.84 P1.8
P22: length 37.8
  Top Layer w0.203: P1.7 43.84,38.59 41.15,41.27 24.26,41.27 SW3.11
  Top Layer w0.254: P1.7 43.84,28.84 U1.34
P23: length 37.8
  Top Layer w0.203: SW3.12 22.23,40.77 39.12,40.77 41.3,38.59 P1.6
  Top Layer w0.254: P1.6 41.3,28.84 U1.35
P24: length 38.2
  Top Layer w0.203: P1.5 38.74,37.16 38.74,39.37 37.85,40.26 20.19,40.26 SW3.13
  Top Layer w0.254: U1.36 38.76,28.84 P1.5
P25: length 37.1
  Top Layer w0.203: SW3.14 18.16,39.75 33.91,39.75 36.22,37.44 P1.4
  Top Layer w0.254: P1.4 36.22,28.84 U1.37
P26: length 37.2
  Top Layer w0.203: P1.3 33.68,37.57 31.88,39.37 16,39.37 9.02,46.35
  Top Layer w0.254: P1.3 33.68,28.84 U1.38
P27: length 37.3
  Top Layer w0.203: SW3.16 13.97,38.86 30.1,38.86 31.14,37.82 P1.2
  Top Layer w0.254: P1.2 31.24,37.03 U1.39
P30: length 12.5
  Top Layer w0.254: P1.20 76.86,28.84 U1.21 77.82,29.59 R3.2
P31: length 20.4
  Top Layer w0.254: U1.22 74.32,28.84 P1.19 74.32,38.38 75.56,39.62 77.34,39.62 78.87,38.1 78.87,35.54 R4.2
P32: length 21.6
  Top Layer w0.254: U1.23 71.78,28.84 P1.18 71.78,39.9 72.64,40.77 77.83,40.77 R5.1
P33: length 59
  Top Layer w0.203: SW5.6 60.67,20.07 U1.24
  Top Layer w0.254: U1.24 69.24,28.84 P1.17
P34: length 55.4
  Top Layer w0.203: SW5.7 60.67,22.61 U1.25
  Top Layer w0.254: P1.16 66.7,28.84 U1.25
P35: length 51.8
  Top Layer w0.203: SW5.8 60.67,25.15 U1.26
  Top Layer w0.254: P1.15 64.26,37.03 U1.26
P36: length 8.4
  Top Layer w0.254: U1.27 61.62,28.84 P1.14
P37: length 9.3
  Top Layer w0.254: P1.13 59.08,27.81
P41: length 8.4
  Top Layer w0.254: U1.29 56.54,28.84 P1.12
P42: length 8.4
  Top Layer w0.254: U1.30 54.1,37.03 P1.11
P44: length 8.4
  Top Layer w0.254: P1.10 51.46,28.84 U1.31
P45: length 8.4
  Top Layer w0.254: P1.1 28.6,28.84 U1.40
P54: length 11.1
  Top Layer w0.254: U1.17 69.34,12.16 68.07,10.89 68.07,5.33 69.47,3.94 69.47,3.56 P2.17
$1N1688: length 27.7
  Top Layer w0.203: K2.1 82.91,53.21 89.28,53.21 90.82,51.67 R2.1
  Top Layer w0.254: R2.1 R5.2
$1N1822: length 27.6
  Top Layer w0.25: USB1.2 83.98,32.6 87,29.59 R3.1
$1N1826: length 20.9
  Top Layer w0.25: R4.1 89.79,33.78 85.98,37.59 USB1.3
$1N2054: length 5.2
  Top Layer w0.254: U1.16 66.8,8
$1N3268: length 3.6
  Top Layer w0.254: R8.2 LED4.1
$1N3345: length 3.6
  Top Layer w0.254: LED5.1 68.33,53.76 R9.2
$1N3423: length 3.4
  Top Layer w0.254: 62.63,57.02 62.61,57 62.61,53.76 R10.2
$1N3487: length 91.8
  Top Layer w0.203: 19.18,53.97 13.21,48.01 3.94,48.01 1.65,50.29 1.65,62.74 4.06,65.15 51.56,65.15 56.9,59.82
$1N3491: length 43.2
  Top Layer w0.203: LED6.2 61.49,58.42 26.16,58.42 21.72,53.97
$1N3495: length 50.7
  Top Layer w0.203: LED5.2 65.79,57.15 65.79,53.09 64.39,51.69 26.54,51.69 24.26,53.97
$1N3652: length 3.6
  Top Layer w0.254: LED8.1 45.54,53.84 R12.2
$1N3729: length 3.8
  Top Layer w0.254: R13.2 51.24,53.82 LED9.1
$1N3822: length 3.5
  Top Layer w0.254: LED10.1 39.88,57.11 R14.2
$1N3899: length 3.7
  Top Layer w0.254: LED11.1 34.15,53.75 R15.2
$1N3906: length 80.1
  Top Layer w0.203: LED9.2 46.79,64.39 4.83,64.39 2.54,62.1 2.54,50.29 3.94,48.89 11.56,48.89 16.64,53.97
$1N3914: length 67.8
  Top Layer w0.203: 14.1,53.97 10.16,50.04 3.76,50.04 3.56,50.24 3.56,61.47 5.54,63.45 41.78,63.45 LED8.2
$1N3922: length 55.4
  Top Layer w0.203: 11.56,53.97 8.76,51.18 4.45,51.18 4.45,60.96 6.22,62.74 36.79,62.74 LED10.2
$1N4027: length 2.7
  Top Layer w0.254: 28.45,57.02 28.45,54.36
$1N4031: length 42.7
  Top Layer w0.203: 34.15,59.82 32.24,61.72 6.35,61.72 5.32,60.7 5.32,52.53 5.53,52.32 7.37,52.32 9.02,53.97
$1N4039: length 28.8
  Top Layer w0.203: 6.48,53.97 6.48,59.82 7.49,60.83 27.18,60.83 LED12.2
$1N4277: length 7.1
  Top Layer w0.203: SW5.2 14.5,20.3 7.71,20.3
$1N4282: length 8.4
  Top Layer w0.203: K4.2 11.53,14.33 SW5.1
$1N4288: length 8.9
  Top Layer w0.203: K1.2 10.31,27.03 SW5.3
$1N5607: length 8.6
  Top Layer w0.203: LED13.1 81.58,52.75 R17.2

## Copper pours and planes (outline as drawn; the poured copper is in the pictures)
GND on Top Layer: 0,66.44 96.01,66.44 96.01,0.15 0,0.15
GND on Bottom Layer: 0,66.67 96.01,66.67 96.01,-0.25 0,-0.25

## Text on the board
Top Silkscreen Layer: VCC | GND | +5V | P45 | P00 | P27 | P01 | P26 | P02 | P03 | P25 | P04 | P24 | P05 | P23 | P06 | P22 | P07 | P37 | P20 | P10 | P11 | P44 | P14 | P42 | P15 | P41 | P16 | P17 | P36 | P35 | P13 | P34 | P54 | P33 | P32 | P31 | P30 | 闫朝文 / 2120201848 / 2023/05/05
